# Altium project PWM.PrjPcb
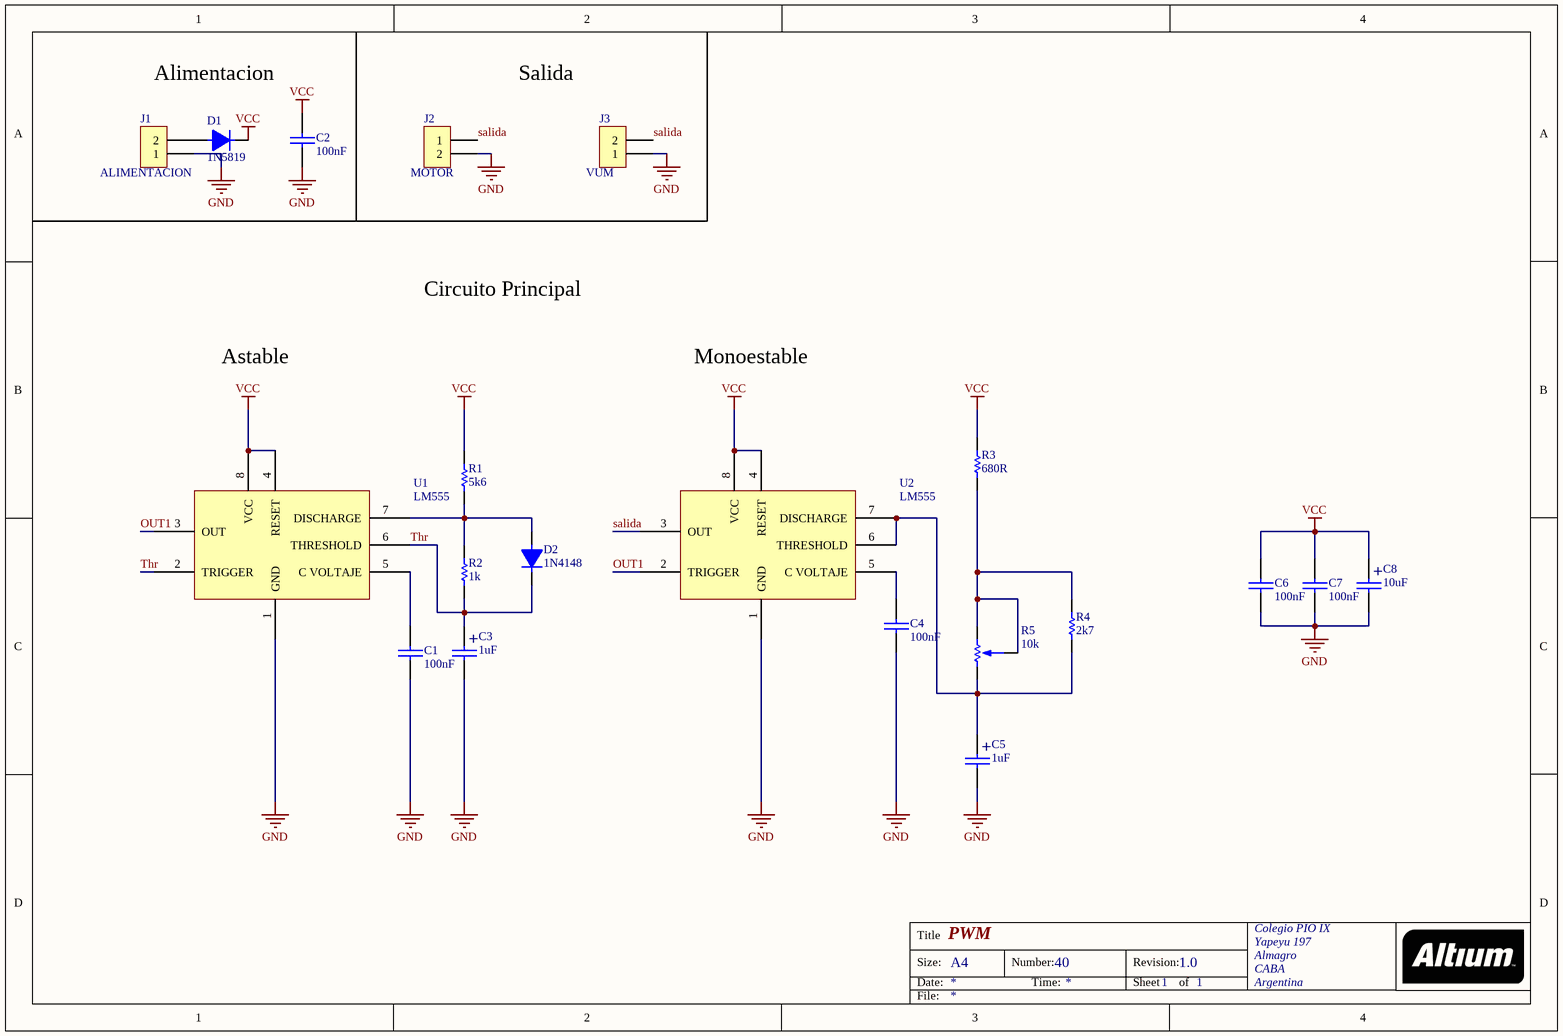
[diagram p0: esquetematico PWM.SchDoc]
1 sheet, 20 parts. Net scope: global (net labels, ports and power ports of the same name join across sheets).
Board files: PCB de PWM.PcbDoc, panel.PcbDoc

## Sheet esquetematico PWM.SchDoc: PWM
size A4; Date: 05/05/18; DrawnBy: SPATARO, Guido; Organization: Colegio PIO IX; Address1: Yapeyu 197; Address2: Almagro; Address3: CABA; Address4: Argentina; DocumentNumber: 40; Revision: 1.0; SheetNumber: 1; SheetTotal: 1

### Parts
C1  100nF  [CAP100]
C2  100nF  [CAP100]
C3  1uF  [CAP100RP]
C4  100nF  [CAP100]
C5  1uF  [CAP100RP]
C6  100nF  [CAP200]
C7  100nF  [CAP200]
C8  10uF  [CAP100RP]
D1  1N5819  [DO41]
D2  1N4148  [DO41]
J1  ALIMENTACION  [BORNERA2]
J2  MOTOR  [BORNERA2]
J3  VUM  [BORNERA2]
R1  5k6  [RES400]
R2  1k  [RES400]
R3  680R  [RES400]
R4  2k7  [RES400]
R5  10k  [PRESET V]
U1  LM555  [DIP8]
U2  LM555  [DIP8]

### Nets
GND: C1.2 C2.2 C3.2 C4.2 C5.2 C6.2 C7.2 C8.2 J1.1 J2.2 J3.1 U1.1(GND) U2.1(GND)
VCC: C2.1 C6.1 C7.1 C8.1 D1.2 R1.2 R3.2 U1.4(RESET) U1.8(VCC) U2.4(RESET) U2.8(VCC)
OUT1: U1.3(OUT) U2.2(TRIGGER)
salida: J2.1 J3.2 U2.3(OUT)
Thr: C3.1 D2.2 R2.1 U1.2(TRIGGER) U1.6(THRESHOLD)
NetC1_1: C1.1 U1.5(C_VOLTAJE)
NetC4_1: C4.1 U2.5(C_VOLTAJE)
NetC5_1: C5.1 R4.1 R5.3 U2.6(THRESHOLD) U2.7(DISCHARGE)
NetD1_1: D1.1 J1.2
NetD2_1: D2.1 R1.1 R2.2 U1.7(DISCHARGE)
NetR3_1: R3.1 R4.2 R5.1 R5.2

### Notes on the sheet
- Alimentacion
- Salida
- Circuito Principal
- Astable
- Monoestable
- Title
- Size:
- Date:
- A4
- Number:
- Time:
- Revision:
- Sheet
- of
- File:
- (in symbol CAPPOL) +

### Library data of the parts
C1 C2 C4 C6 C7 = CAP
C3 C5 C8 = CAPPOL
D1 D2 = DIODO
J1-J3 = BORNERA 2
R1-R4 = RES
R5 = PRESET
U1 U2 = LM555: Timer